# Altium schematic sheet EndEffector2018_19.SchDoc
size A
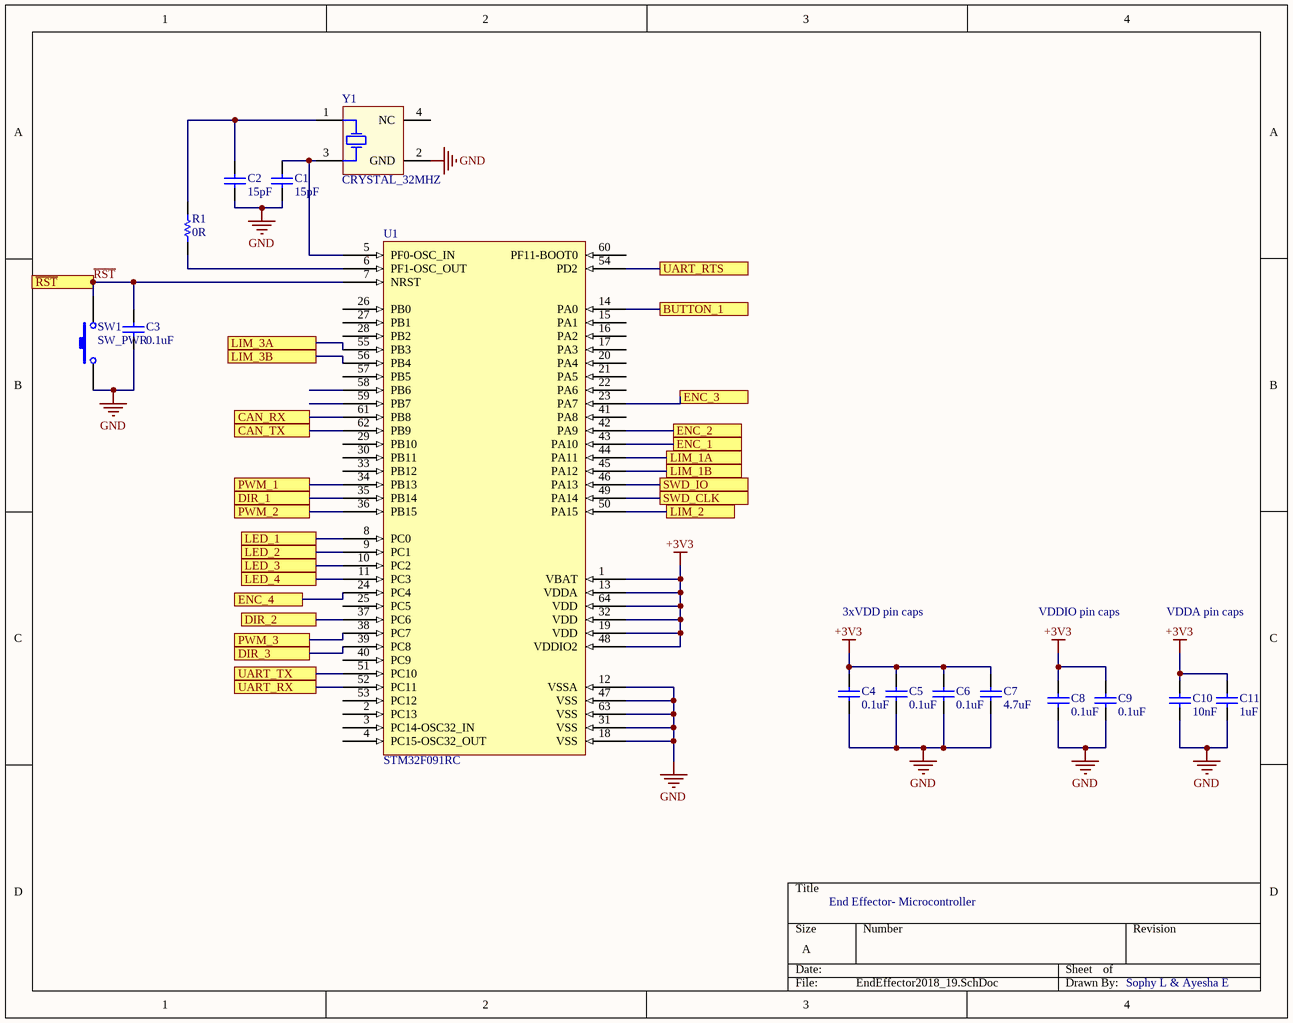
[diagram p0: EndEffector2018_19.SchDoc]

## Parts
C1  value 15pF  [CAPC0603(1608)55_N]  (hidden comment: CAP_15pF_0603)
C2  value 15pF  [CAPC0603(1608)55_N]  (hidden comment: CAP_15pF_0603)
C3  value 0.1uF  [CAPC0603(1608)55_N]  (hidden comment: CAP_0.1uF_16V_0603)
C4  value 0.1uF  [CAPC0603(1608)55_N]  (hidden comment: CAP_0.1uF_16V_0603)
C5  value 0.1uF  [CAPC0603(1608)55_N]  (hidden comment: CAP_0.1uF_16V_0603)
C6  value 0.1uF  [CAPC0603(1608)55_N]  (hidden comment: CAP_0.1uF_16V_0603)
C7  value 4.7uF  [CAPC0603(1608)55_N]  (hidden comment: CAP_4.7uF_0603)
C8  value 0.1uF  [CAPC0603(1608)55_N]  (hidden comment: CAP_0.1uF_16V_0603)
C9  value 0.1uF  [CAPC0603(1608)55_N]  (hidden comment: CAP_0.1uF_16V_0603)
C10  value 10nF  [CAPC0603(1608)55_N]  (hidden comment: CAP_10nF_0603)
C11  value 1uF  [CAPC0603(1608)55_N]  (hidden comment: CAP_1uF_16V_0603)
R1  value 0R  [RESC0201(0603)_N]  (hidden comment: RES_0R_0603)
SW1  SW_PWR  [SPST-2]
U1  STM32F091RC  [STM-LQFP64_M]
Y1  CRYSTAL_32MHZ  [AVX-CX2520DB32000D0GEJZ1-4_V]

## Ports
BUTTON_1, CAN_RX, CAN_TX, DIR_1, DIR_2, DIR_3, ENC_1, ENC_2, ENC_3, ENC_4, LED_1, LED_2, LED_3, LED_4, LIM_1A, LIM_1B, LIM_2, LIM_3A, LIM_3B, PWM_1, PWM_2, PWM_3, SWD_CLK, SWD_IO, UART_RTS, UART_RX, UART_TX, ~{RST} (in)

## Nets
+3V3: C4.2 C5.2 C6.2 C7.2 C8.2 C9.2 C10.2 C11.2 U1.1(VBAT) U1.13(VDDA) U1.19(VDD) U1.32(VDD) U1.48(VDDIO2) U1.64(VDD)
GND: C1.1 C2.1 C3.1 C4.1 C5.1 C6.1 C7.1 C8.1 C9.1 C10.1 C11.1 SW1.1 U1.12(VSSA) U1.18(VSS) U1.31(VSS) U1.47(VSS) U1.63(VSS) Y1.2(GND)
BUTTON_1: U1.14(PA0) ; port BUTTON_1
CAN_RX: U1.61(PB8) ; port CAN_RX
CAN_TX: U1.62(PB9) ; port CAN_TX
DIR_1: U1.35(PB14) ; port DIR_1
DIR_2: U1.37(PC6) ; port DIR_2
DIR_3: U1.39(PC8) ; port DIR_3
ENC_1: U1.43(PA10) ; port ENC_1
ENC_2: U1.42(PA9) ; port ENC_2
ENC_3: U1.23(PA7) ; port ENC_3
ENC_4: U1.24(PC4) ; port ENC_4
LED_1: U1.8(PC0) ; port LED_1
LED_2: U1.9(PC1) ; port LED_2
LED_3: U1.10(PC2) ; port LED_3
LED_4: U1.11(PC3) ; port LED_4
LIM_1A: U1.44(PA11) ; port LIM_1A
LIM_1B: U1.45(PA12) ; port LIM_1B
LIM_2: U1.50(PA15) ; port LIM_2
LIM_3A: U1.55(PB3) ; port LIM_3A
LIM_3B: U1.56(PB4) ; port LIM_3B
PWM_1: U1.34(PB13) ; port PWM_1
PWM_2: U1.36(PB15) ; port PWM_2
PWM_3: U1.38(PC7) ; port PWM_3
~{RST}: C3.2 SW1.2 U1.7(NRST) ; port ~{RST}
SWD_CLK: U1.49(PA14) ; port SWD_CLK
SWD_IO: U1.46(PA13) ; port SWD_IO
UART_RTS: U1.54(PD2) ; port UART_RTS
UART_RX: U1.52(PC11) ; port UART_RX
UART_TX: U1.51(PC10) ; port UART_TX
NetC1_2: C1.2 U1.5(PF0-OSC_IN) Y1.3(HOT)
NetC2_2: C2.2 R1.2 Y1.1(HOT)
NetR1_1: R1.1 U1.6(PF1-OSC_OUT)

Not connected (* = marked no-connect by the designer): U1 2(PC13) 3(PC14-OSC32_IN) 4(PC15-OSC32_OUT) 15(PA1) 16(PA2) 17(PA3) 20(PA4) 21(PA5) 22(PA6) 25(PC5) 26(PB0) 27(PB1) 28(PB2) 29(PB10) 30(PB11) 33(PB12) 40(PC9) 41(PA8) 53(PC12) 57(PB5) 58(PB6) 59(PB7) 60(PF11-BOOT0); Y1 4(NC)

## Notes on the sheet
- 3xVDD pin caps
- VDDIO pin caps
- VDDA pin caps
- End Effector- Microcontroller
- Sophy L & Ayesha E

## Library data of the parts
C1 C2 = CAP_15pF_0603: CAP CER 15PF 250V NPO 0603; Part Number: AC0603JRNPOYBN150; Manufacturer: Yageo; Temperature Coefficient: NP0; Dimensions: 0.063" L x 0.031" W (1.60mm x 0.80mm); Package: 0603 (1608 Metric); Voltage Rating: 250v
C3-C6 C8 C9 = CAP_0.1uF_16V_0603: CAP CER 0.1UF 16V X7R 0603; Part Number: CC0603KRX7R7BB104; Manufacturer: Yageo; Dimensions: 0.063" L x 0.031" W (1.60mm x 0.80mm); Package: 0603 (1608 Metric); Temperature Coefficient: X7R; Voltage Rating: 16V
C7 = CAP_4.7uF_0603: CAP CER 4.7UF 6.3V X5R 0603; Part Number: CC0603KRX5R5BB475; Manufacturer: Yageo; Dimensions: 0.063" L x 0.031" W (1.60mm x 0.80mm); Package: 0603 (1608 Metric); Temperature Coefficient: X5R; Voltage Rating: 6.3V
C10 = CAP_10nF_0603: CAP CER 10000PF 16V X7R 0603; Part Number: CC0603KRX7R7BB103; Manufacturer: Yageo; Dimensions: 0.063" L x 0.031" W (1.60mm x 0.80mm); Package: 0603 (1608 Metric); Temperature Coefficient: X7R; Voltage Rating: 16V
C11 = CAP_1uF_16V_0603: CAP CER 1UF 16V Y5V 0603; Part Number: CC0603ZRY5V7BB105; Manufacturer: Yageo; Dimensions: 0.063" L x 0.031" W (1.60mm x 0.80mm); Package: 0603 (1608 Metric); Temperature Coefficient: Y5V; Voltage Rating: 16V
R1 = RES_0R_0603: RES SMD 0 OHM JUMPER 1/10W 0603; Manufacturer: Yageo; Part Number (MPN): RC0603JR-070RL; Package: 0603 (1608 Metric); Dimensions: 0.063" L x 0.031" W (1.60mm x 0.80mm)
SW1 = SW_PWR: Switch; Published: 24-Mar-1999; LatestRevisionDate: 17-Jul-2002; LatestRevisionNote: Re-released for DXP Platform.; PackageReference: SPST-2; Publisher: Altium Limited; PackageDescription: Switch; 2 Leads
U1 = STM32F091RC: Manufacturer: STMicroelectronics; Part Number: STM32F091RC; Package: 64-LQFP; ComponentLink1Description: Datasheet; ComponentLink1URL: https://www.st.com/content/ccc/resource/technical/document/datasheet/95/3c/2e/5b/21/09/45/a6/DM00115237.pdf/files/DM00115237.pdf/jcr:content/translations/en.DM00115237.pdf#%5B%7B%22num%22%3A96%2C%22gen%22%3A0%7D%2C%7B%22name%22%3A%22XYZ%22%7D%2C67%2C755%2Cnull%5D
Y1 = CRYSTAL_32MHZ: CRYSTAL 32MHZ 8PF SMD; Part Number: CX2520DB32000D0GPSC1; Manufacturer: Kyocera International Inc. Electronic Components; Package: 4-SMD, No Lead; Dimensions: 0.098" L x 0.079" W (2.50mm x 2.00mm)